# EAGLE schematic ODB21 (EAGLE 9.2.2)
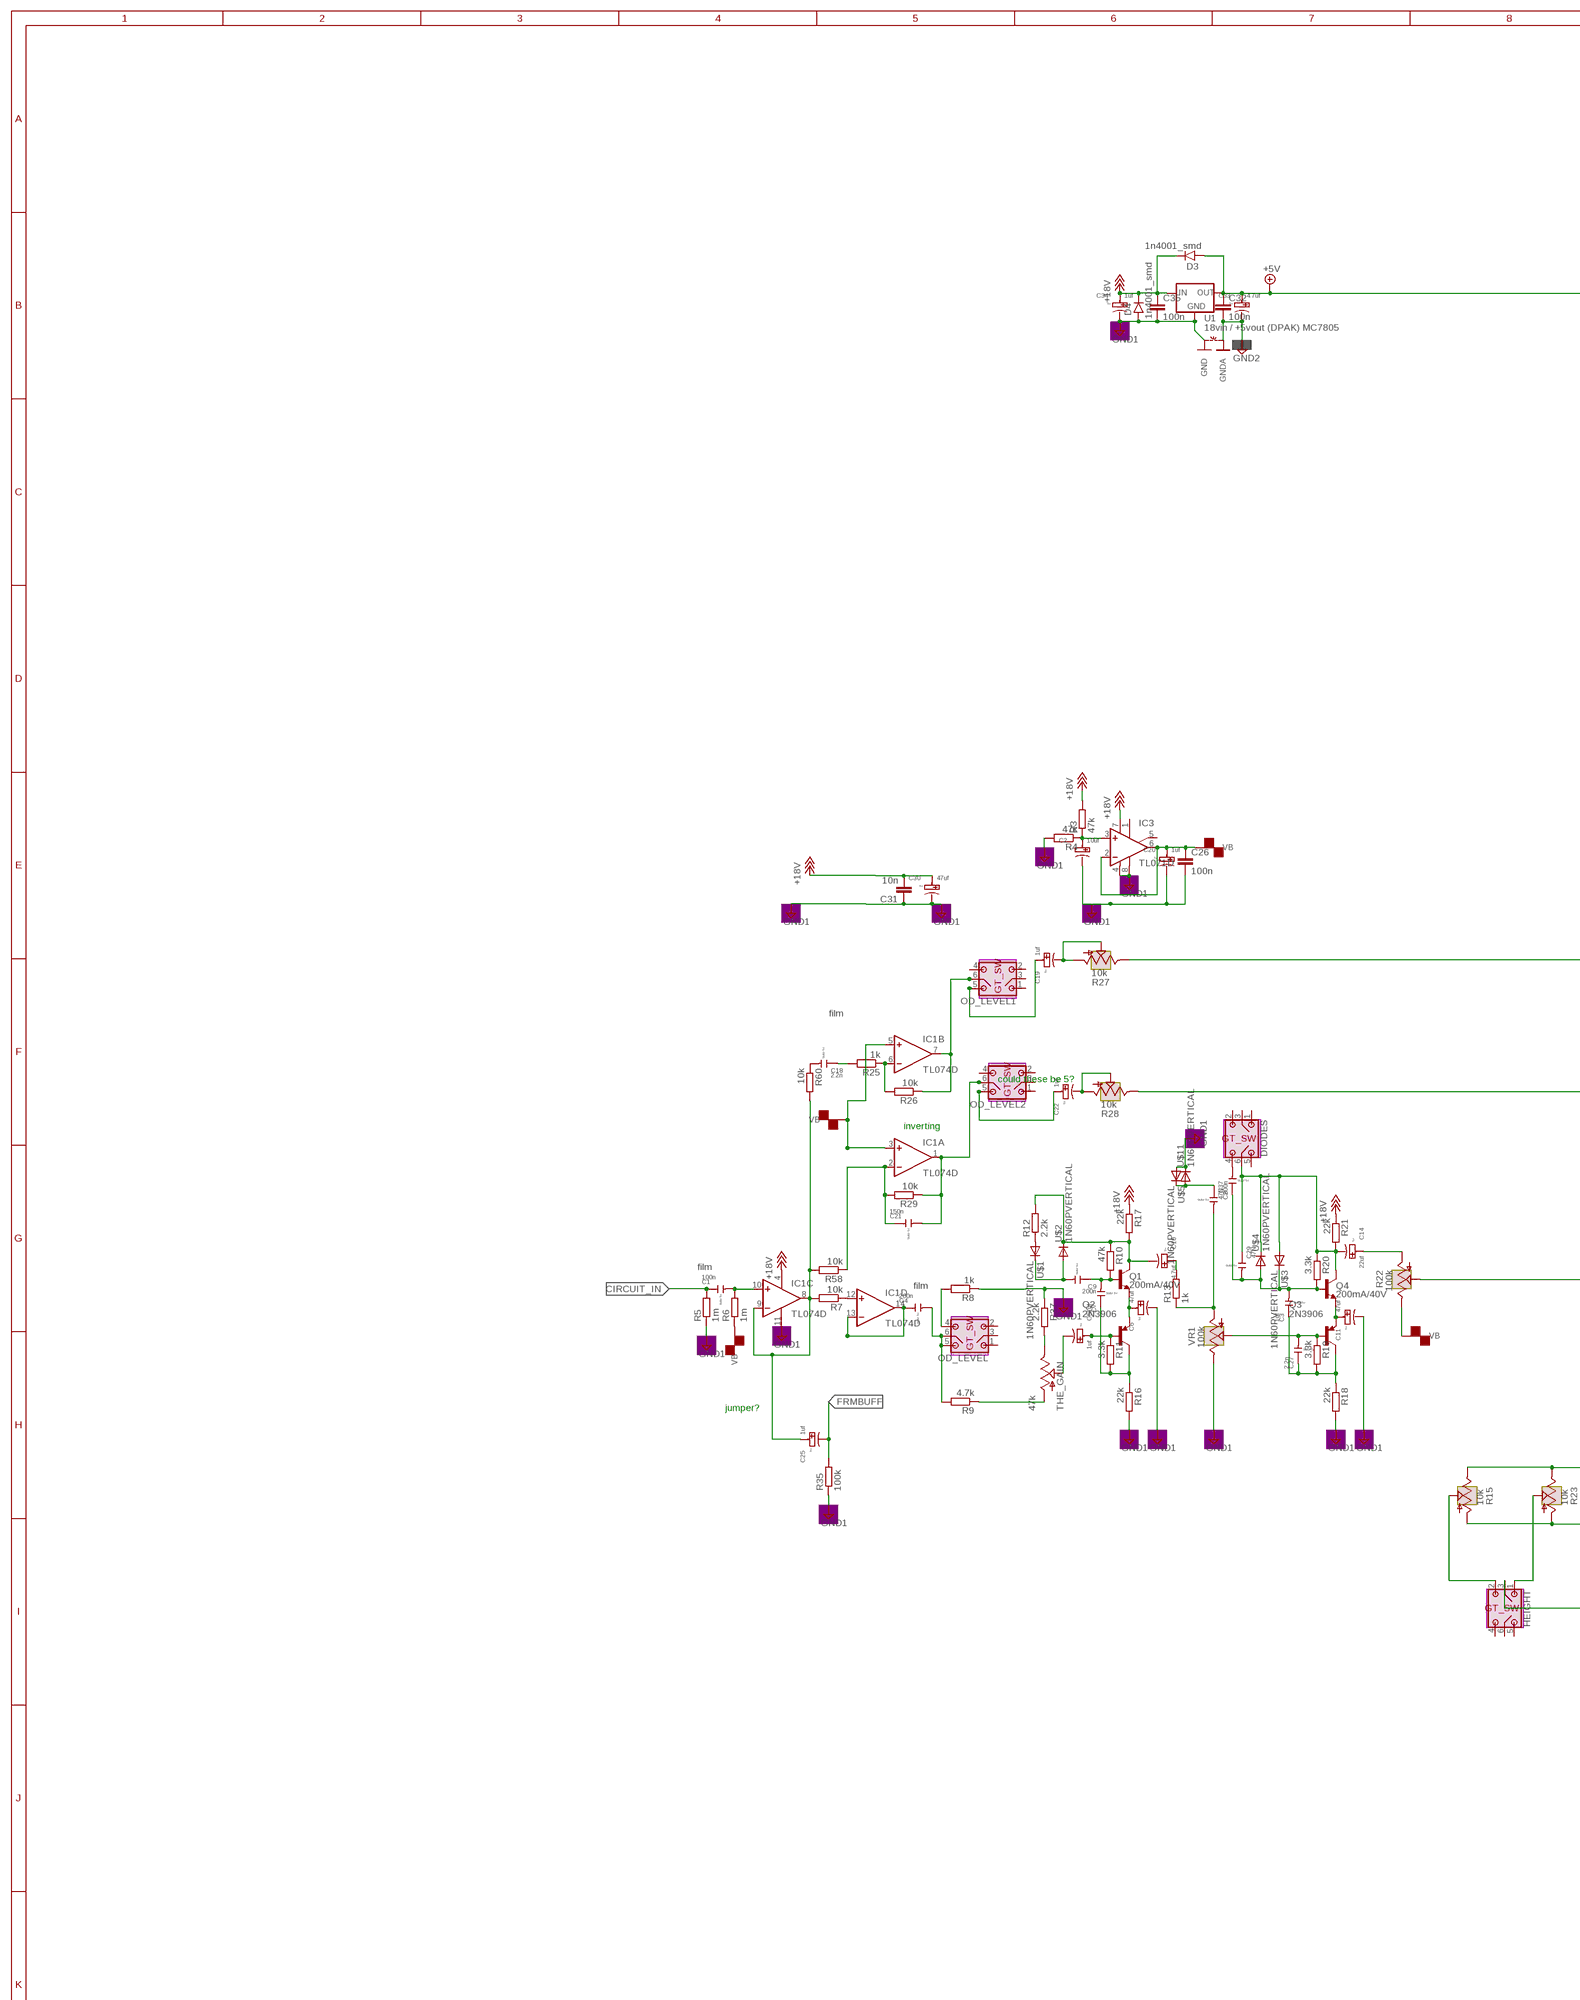
[diagram p0: schematic, sheet 1, part 1 of 3]
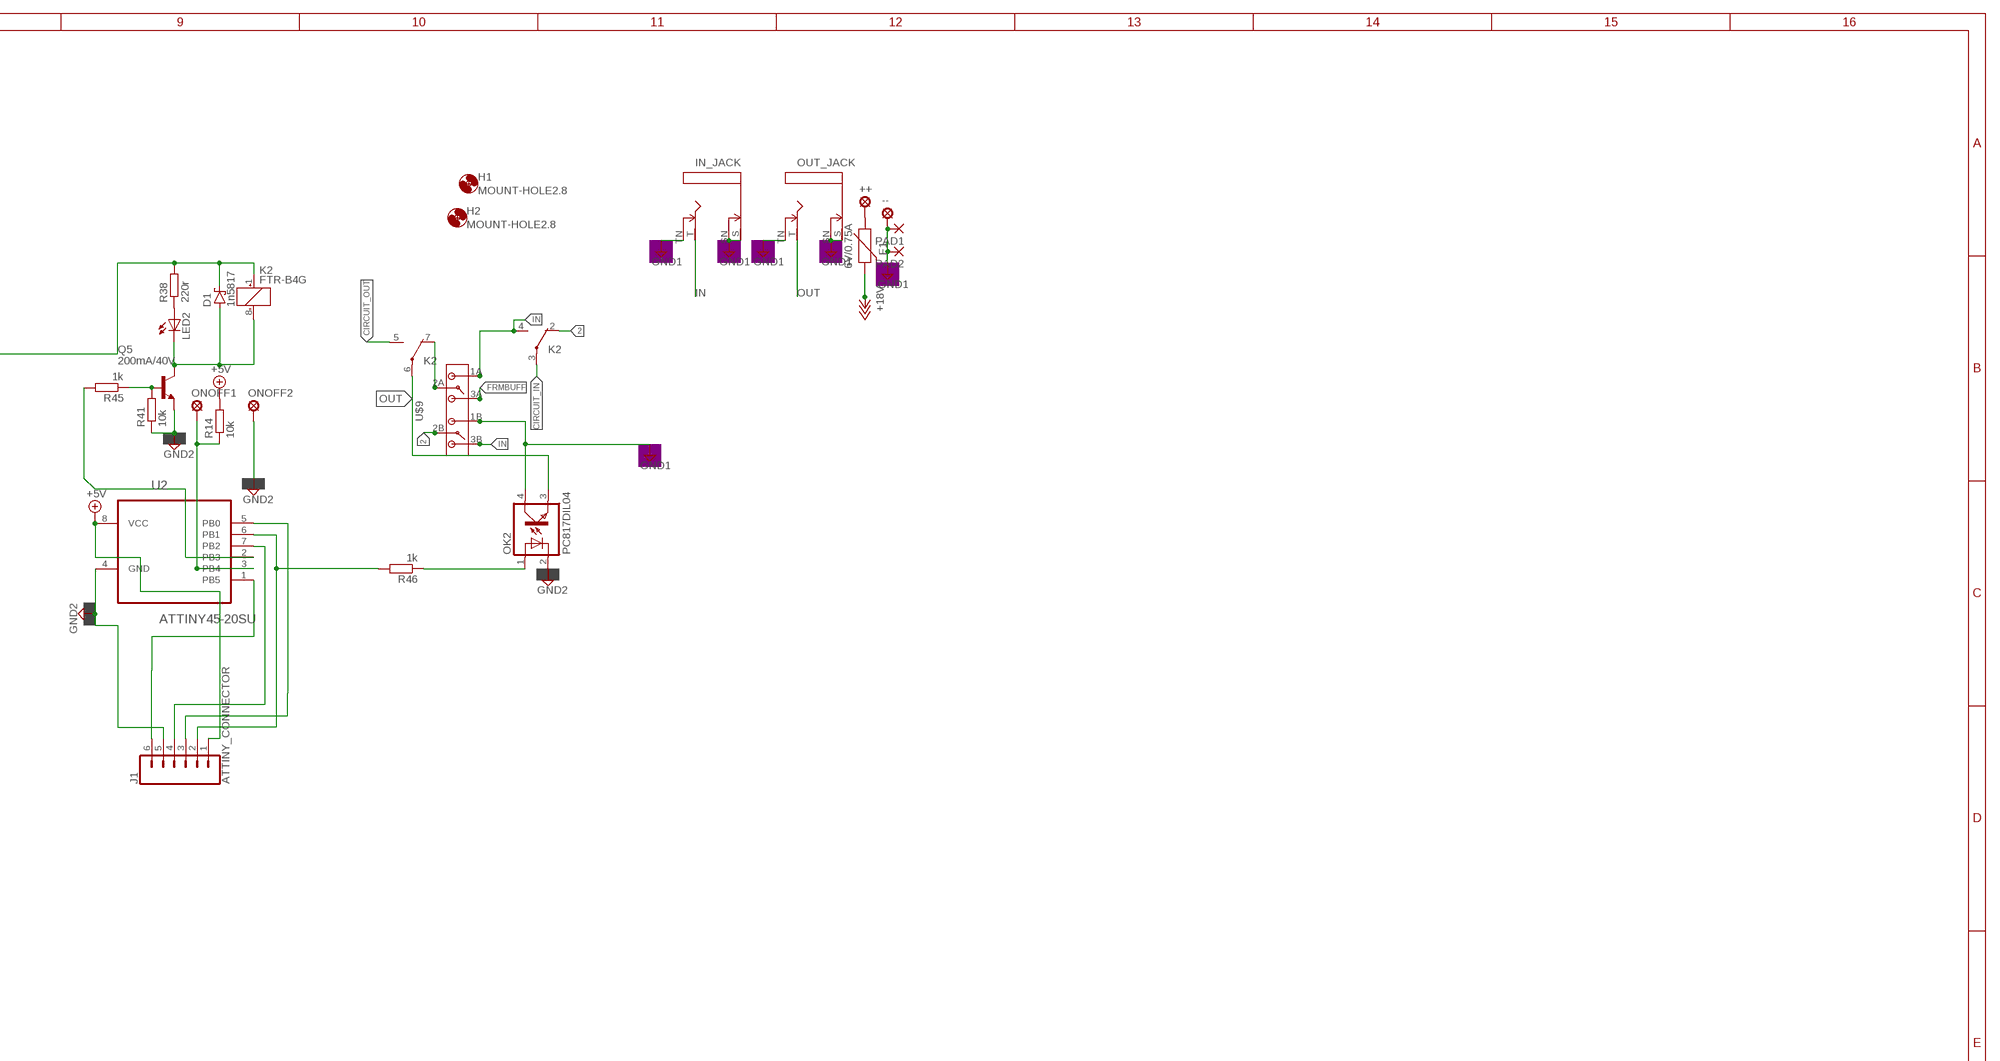
[diagram p1: schematic, sheet 1, part 2 of 3]
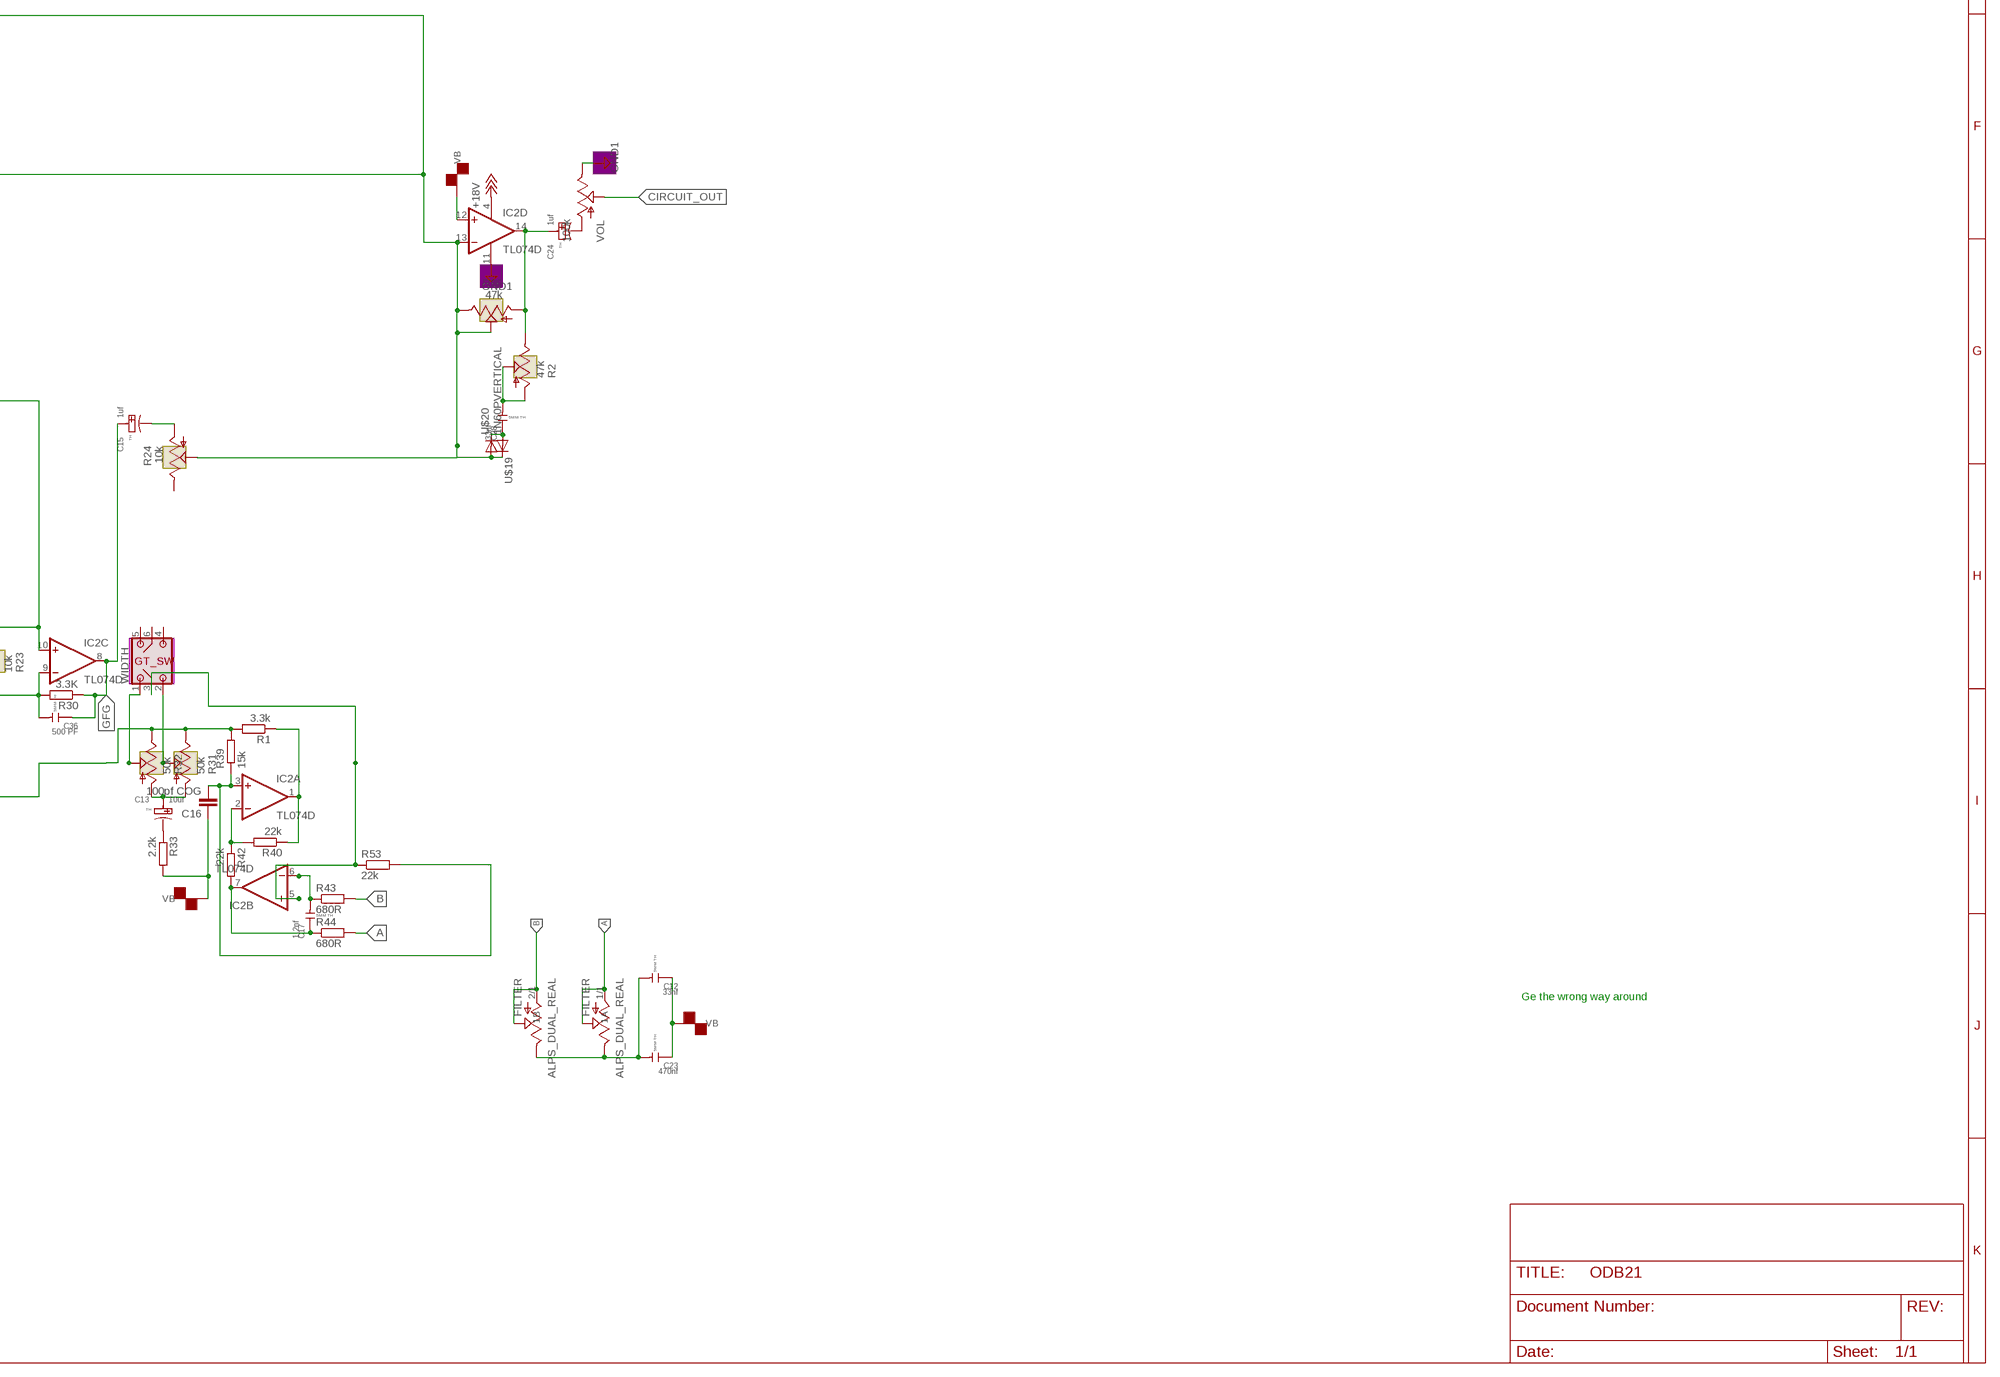
[diagram p2: schematic, sheet 1, part 3 of 3]

## Parts
++  LSP10  [LSP10]
--  LSP10  [LSP10]
C1  100n  THRU_HOLE_5MM_SPACING  [CERAMIC-5MM]
C2  10uf  THRU-HOLE-POLARIZED  [PC-D5.3MM]
C3  1uf  THRU_HOLE_5MM_SPACING  [CERAMIC-5MM]
C4  200n  THRU_HOLE_5MM_SPACING  [CERAMIC-5MM]
C5  1uf  THRU-HOLE-POLARIZED  [PC-D5.3MM]
C6  47uf  THRU-HOLE-POLARIZED  [PC-D5.3MM]
C7  1uf  THRU_HOLE_5MM_SPACING  [CERAMIC-5MM]
C8  47N  THRU_HOLE_5MM_SPACING  [CERAMIC-5MM]
C9  200n  THRU_HOLE_5MM_SPACING  [CERAMIC-5MM]
C10  4.7uf  THRU-HOLE-POLARIZED  [PC-D5.3MM]
C11  47uf  THRU-HOLE-POLARIZED  [PC-D5.3MM]
C12  33nf  THRU_HOLE_5MM_SPACING  [CERAMIC-5MM]
C13  10uf  THRU-HOLE-POLARIZED  [PC-D5.3MM]
C14  22uf  THRU-HOLE-POLARIZED  [PC-D5.3MM]
C15  1uf  THRU-HOLE-POLARIZED  [PC-D5.3MM]
C16  100pf COG  C-EUC1206  [C1206]
C17  1.2nf  THRU_HOLE_5MM_SPACING  [CERAMIC-5MM]
C18  2.2n  THRU_HOLE_5MM_SPACING  [CERAMIC-5MM]
C19  1uf  THRU-HOLE-POLARIZED  [PC-D5.3MM]
C20  1uf  THRU-HOLE-POLARIZED  [PC-D5.3MM]
C21  150n  THRU_HOLE_5MM_SPACING  [CERAMIC-5MM]
C22  1uf  THRU-HOLE-POLARIZED  [PC-D5.3MM]
C23  470nf  THRU_HOLE_5MM_SPACING  [CERAMIC-5MM]
C24  1uf  THRU-HOLE-POLARIZED  [PC-D5.3MM]
C25  1uf  THRU-HOLE-POLARIZED  [PC-D5.3MM]
C26  100n  C-EUC1206  [C1206]
C27  2.2n  THRU_HOLE_5MM_SPACING  [CERAMIC-5MM]
C28  33nf  THRU_HOLE_5MM_SPACING  [CERAMIC-5MM]
C29  47N  THRU_HOLE_5MM_SPACING  [CERAMIC-5MM]
C30  47uf  THRU-HOLE-POLARIZED  [PC-D5.3MM]
C31  10n  C-EUC1206  [C1206]
C32  100n  C-EUC1206  [C1206]
C33  4.7uf  THRU-HOLE-POLARIZED  [PC-D5.3MM]
C34  1uf  THRU-HOLE-POLARIZED  [PC-D5.3MM]
C35  100n  C-EUC1206  [C1206]
C36  500 PF  THRU_HOLE_5MM_SPACING  [CERAMIC-5MM]
C37  200n  THRU_HOLE_5MM_SPACING  [CERAMIC-5MM]
D1  1n5817  SCHOTTKY-DIODESMD  [SMB]
D3  1n4001_smd  1N400X.1  [DO41-1]
D4  1n4001_smd  1N400X.1  [DO41-1]
DIODES  DP03  [DP-03]
F1  6V/0.75A  PPTC_THREE-QUARTER-AMP  [1206]
FILTER  ALPS_DUAL_REAL  [ALPS_QUAD]
H1  MOUNT-HOLE2.8  [2,8]
H2  MOUNT-HOLE2.8  [2,8]
HEIGHT  DP03  [DP-03]
IC1  TL074D  [SO14]
IC2  TL074D  [SO14]
IC3  TL071D  [SO08]
IN_JACK  MMMONNN  [MONO]
J1  ATTINY_CONNECTOR  CONN_06LONGPADS  [1X06_LONGPADS]
K2  FTR-B4G  [FTR-B4G]
LED2  LED3MM  [LED3MM]
OD_LEVEL  DP03  [DP-03]
OD_LEVEL1  DP03  [DP-03]
OD_LEVEL2  DP03  [DP-03]
OK2  PC817DIL04  [SMD4]
ONOFF1  LSP10  [LSP10]
ONOFF2  LSP10  [LSP10]
OUT_JACK  MMMONNN  [MONO]
PAD1  SMD5  [SMD2,54-5,08]
PAD2  SMD5  [SMD2,54-5,08]
Q1  200mA/40V  TRANS_NPN-2N3904  [TO-92]
Q2  2N3906  [TO92]
Q3  2N3906  [TO92]
Q4  200mA/40V  TRANS_NPN-2N3904  [TO-92]
Q5  200mA/40V  BC547  [TO92]
R1  3.3k  R-EU_R1206  [R1206]
R2  47k  TRIM_US-B25P  [B25P]
R3  47k  R-EU_R1206  [R1206]
R4  47k  R-EU_R1206  [R1206]
R5  1m  R-EU_R1206  [R1206]
R6  1m  R-EU_R1206  [R1206]
R7  10k  R-EU_R1206  [R1206]
R8  1k  R-EU_R1206  [R1206]
R9  4.7k  R-EU_R1206  [R1206]
R10  47k  R-EU_R1206  [R1206]
R11  3.3k  R-EU_R1206  [R1206]
R12  2.2k  R-EU_R1206  [R1206]
R13  1k  R-EU_R1206  [R1206]
R14  10k  R-EU_M1206  [M1206]
R15  10k  TRIM_US-3223G  [3223G]
R16  22k  R-EU_R1206  [R1206]
R17  22k  R-EU_R1206  [R1206]
R18  22k  R-EU_R1206  [R1206]
R19  3.3k  R-EU_R1206  [R1206]
R20  3.3k  R-EU_R1206  [R1206]
R21  22k  R-EU_R1206  [R1206]
R22  100k  TRIM_US-3223G  [3223G]
R23  10k  TRIM_US-3223G  [3223G]
R24  10k  TRIM_US-3223G  [3223G]
R25  1k  R-EU_R1206  [R1206]
R26  10k  R-EU_R1206  [R1206]
R27  10k  TRIM_US-3223G  [3223G]
R28  10k  TRIM_US-3223G  [3223G]
R29  10k  R-EU_R1206  [R1206]
R30  3.3K  R-EU_R1206  [R1206]
R31  50k  TRIM_US-3223G  [3223G]
R32  50k  TRIM_US-3223G  [3223G]
R33  2.2k  R-EU_R1206  [R1206]
R35  100k  R-EU_R1206  [R1206]
R36  47k  TRIM_US-3223G  [3223G]
R37  2.2k  R-EU_R1206  [R1206]
R38  220r  R-EU_M1206  [M1206]
R39  15k  R-EU_R1206  [R1206]
R40  22k  R-EU_R1206  [R1206]
R41  10k  R-EU_M1206  [M1206]
R42  22k  R-EU_R1206  [R1206]
R43  680R  R-EU_R1206  [R1206]
R44  680R  R-EU_R1206  [R1206]
R45  1k  R-EU_M1206  [M1206]
R46  1k  R-EU_M1206  [M1206]
R53  22k  R-EU_R1206  [R1206]
R58  10k  R-EU_R1206  [R1206]
R60  10k  R-EU_R1206  [R1206]
THE_GAIN  47k  POT  [ALPS_POT]
U1  18vin / +5vout (DPAK) MC7805  V_REG_78XX7812  [TO-252]
U2  ATTINY45-20SU  [SOIC127P798X216-8N]
U$1  1N60PVERTICAL  [DO41-1]
U$2  1N60PVERTICAL  [DO41-1]
U$3  1N60PVERTICAL  [DO41-1]
U$4  1N60PVERTICAL  [DO41-1]
U$5  1N60PVERTICAL  [DO41-1]
U$9  BYSWITCH  [BUFF/TRBYPASS]
U$11  1N60PVERTICAL  [DO41-1]
U$19  1N60PVERTICAL  [DO41-1]
U$20  1N60PVERTICAL  [DO41-1]
VOL  100k  POT  [ALPS_POT]
VR1  100k  TRIM_US-3223G  [3223G]
WIDTH  DP03  [DP-03]
~NUDEV~1  GND-GNDA1,27MM  [GND-GNDA-1,27MM]

## Nets
2: K2.2(-1:O) U$9.2B
+5V: C32.1 C33.+ D1.C D3.A J1.1 K2.1(K:+) R14.2 R38.2 U1.2(OUT) U2.8(VCC)
+18V: C30.+ C31.2 C34.+ C35.1 D3.C D4.C F1.2 IC1.4(P:V+) IC2.4(P:V+) IC3.7(V+) R3.2 R17.1 R21.1 U1.1(IN)
A: FILTER.1/1(1A) FILTER.1/2(2A) R44.2
B: FILTER.2/1(1B) FILTER.2/2(2B) R43.2
CIRCUIT_IN: C1.1 K2.3(-1:P) R5.2
CIRCUIT_OUT: K2.5(-2:S) VOL.P$2(S)
FRMBUFF: C25.- R35.2 U$9.3A
GFG: C15.+ C36.1 IC2.8(C:OUT) R30.1
GND1: --.MP C2.- C6.- C11.- C20.- C26.2 C30.- C31.1 C34.- C35.2 D4.A IC1.11(P:V-) IC2.11(P:V-) IC3.4(V-) IC3.8(OPT) IN_JACK.S IN_JACK.SN IN_JACK.TN OK2.4(COL) OUT_JACK.S OUT_JACK.SN OUT_JACK.TN PAD1.1(P) PAD2.1(P) R4.2 R5.1 R8.1 R16.2 R18.2 R35.1 R37.1 U1.3(GND) U$5.A U$9.1B U$11.C VOL.P$1(E) VR1.3(E) ~NUDEV~1.GND
GND2: C32.2 C33.- J1.5 OK2.2(C) ONOFF2.MP Q5.1(E) R41.1 U2.4(GND) ~NUDEV~1.GNDA
IN: IN_JACK.T K2.4(-1:S) U$9.1A U$9.3B
N$1: R12.1 U$1.A
N$2: C14.+ R22.1(A)
N$3: C2.+ IC3.3(+IN) R3.1 R4.1
N$4: C9.2 U$1.C U$2.A
N$5: C1.2 IC1.10(C:+IN) R6.2
N$6: C4.2 OD_LEVEL.5 OD_LEVEL.6 R9.2
N$7: C15.- R24.1(A)
N$8: IC1.12(D:+IN) R7.1
N$9: ++.MP F1.1
N$10: C4.1 IC1.13(D:-IN) IC1.14(D:OUT)
N$11: OD_LEVEL.4 R8.2
N$12: R9.1 THE_GAIN.P$3(A)
N$13: C5.- THE_GAIN.P$2(S)
N$14: C5.+ Q2.2(B) R11.1
N$15: C6.+ Q1.1(E) Q2.3(E)
N$16: C7.2 C9.1 Q1.2(B) R10.2
N$17: R37.2 THE_GAIN.P$1(E)
N$18: C7.1 Q2.1(C) R11.2 R16.1
N$19: C37.2 R13.1 VR1.1(A)
N$20: C8.2 DIODES.4
N$21: C22.- R28.1(A) R28.2(S)
N$22: C25.+ IC1.8(C:OUT) IC1.9(C:-IN) R7.2 R58.2 R60.2
N$23: C10.- Q1.3(C) R10.1 R12.2 R17.2 U$2.C
N$24: C24.- VOL.P$3(A)
N$25: C11.+ Q3.3(E) Q4.1(E)
N$26: C10.+ R13.2
N$27: IC2.10(C:+IN) R15.3(E) R22.2(S) R23.3(E)
N$28: C3.1 C27.1 Q3.1(C) R18.1 R19.2
N$29: C27.2 Q3.2(B) R19.1 VR1.2(S)
N$30: C22.+ OD_LEVEL2.5
N$31: C28.2 R2.A R2.S
N$32: C36.2 IC2.9(C:-IN) R15.1(A) R23.1(A) R30.2
N$33: HEIGHT.2 R15.2(S)
N$34: HEIGHT.1 R23.2(S)
N$35: HEIGHT.3 R1.2 R31.3(E) R32.3(E) R39.2
N$36: C18.2 R60.1
N$37: C13.+ R31.1(A) R32.1(A)
N$38: C13.- R33.1
N$39: C16.2 IC2.3(A:+IN) R39.1 R53.2
N$40: R31.2(S) WIDTH.2
N$41: C18.1 R25.2
N$42: C12.2 C23.2 FILTER.1/3(3A) FILTER.2/3(3B)
N$43: IC1.6(B:-IN) R25.1 R26.2
N$44: R32.2(S) WIDTH.1
N$45: IC2.5(B:+IN) R53.1 WIDTH.3
N$46: C19.+ OD_LEVEL1.5
N$47: C19.- R27.1(A) R27.2(S)
N$48: IC2.1(A:OUT) R1.1 R40.1
N$49: C17.1 IC2.7(B:OUT) R42.2 R44.1
N$50: IC2.2(A:-IN) R40.2 R42.1
N$51: C3.2 C8.1 C29.2 Q4.2(B) R20.2 U$3.C U$4.A
N$52: IC1.7(B:OUT) OD_LEVEL1.6 R26.1
N$53: C17.2 IC2.6(B:-IN) R43.1
N$54: C21.2 IC1.1(A:OUT) OD_LEVEL2.6 R29.1
N$55: C37.1 U$5.C U$11.A
N$56: C21.1 IC1.2(A:-IN) R29.2 R58.1
N$57: C28.1 U$19.A U$20.C
N$59: K2.7(-2:O) U$9.2A
N$60: IC2.13(D:-IN) R24.2(S) R27.3(E) R28.3(E) R36.2(S) R36.3(E) U$19.C U$20.A
N$62: C24.+ IC2.14(D:OUT) R2.E R36.1(A)
N$63: C14.- C29.1 DIODES.6 Q4.3(C) R20.1 R21.2 U$3.A U$4.C
N$74: J1.3 U2.5(PB0)
N$75: J1.2 R46.2 U2.6(PB1)
N$76: J1.4 U2.7(PB2)
N$77: J1.6 U2.1(PB5)
N$78: LED2.A R38.1
N$79: D1.A K2.8(K:-) LED2.K(C) Q5.3(C)
N$84: Q5.2(B) R41.2 R45.1
N$85: R45.2 U2.2(PB3)
N$87: ONOFF1.MP R14.1 U2.3(PB4)
N$88: OK2.1(A) R46.1
OUT: K2.6(-2:P) OK2.3(EMIT) OUT_JACK.T
VB: C12.1 C16.1 C20.+ C23.1 C26.1 IC1.3(A:+IN) IC1.5(B:+IN) IC2.12(D:+IN) IC3.2(-IN) IC3.6(OUT) R6.1 R22.3(E) R33.2
Unconnected: DIODES.1 DIODES.2 DIODES.3 DIODES.5 HEIGHT.4 HEIGHT.5 HEIGHT.6 IC3.1(ON1) IC3.5(ON2) OD_LEVEL1.1 OD_LEVEL1.2 OD_LEVEL1.3 OD_LEVEL1.4 OD_LEVEL2.1 OD_LEVEL2.2 OD_LEVEL2.3 OD_LEVEL2.4 OD_LEVEL.1 OD_LEVEL.2 OD_LEVEL.3 R24.3(E) WIDTH.4 WIDTH.5 WIDTH.6

## Notes on the sheet
- film
- could these be 5?
- inverting
- film
- film
- jumper?
- Ge the wrong way around

## Library data of the parts
++ -- ONOFF1 ONOFF2 = solpad:LSP10: SOLDER PAD drill 1.0 mm, distributor Buerklin, 12H555
C1 C3 C4 C7-C9 C12 C17 C18 C21 C23 C27-C29 C36 C37 = GT_Capacitor:THRU_HOLE_5MM_SPACING: 302010202; PACKAGE: 5MM TH
C2 C5 C6 C10 C11 C13-C15 C19 C20 C22 C24 C25 C30 C33 C34 = GT_Capacitor:THRU-HOLE-POLARIZED: 302030033; PACKAGE: TH
C16 C26 C31 C32 C35 = resistor:C-EU: CAPACITOR, European symbol
D1 = diode:SCHOTTKY-DIODE: Schottky Diode
D3 D4 = gm-diodes:1N400X: Rectifier Diodes often used in power supply to prevent damage from reverse polarization
DIODES HEIGHT OD_LEVEL OD_LEVEL1 OD_LEVEL2 WIDTH = switch-dil:DP03: DIL/CODE SWITCH; MPN: MCDP03; OC_FARNELL: 1522004; OC_NEWARK: 74M2976
F1 = GOLDTOOTH-Fuses:PPTC: Resettable Fuse PPTC Resettable Fuse. Really a sort of resistor with a polymeric positive temperature coefficient whose resistance increases dramatically with an increase in temperature. When heated by the power passing through the resistance rises causing the current to be limited, protecting the circuit. This is achieved by the transition of the polymer from a crystalline to an amorphous state where the conductive carbon separates breaking the conductive pathways found in the cool crystalline structure. When a PPTC cools back down it resumes conducting letting the circuit turn back on. SparkFun Products: SparkFun RedBoard - Programmed with Arduino <https://www.sparkfun.com/products/12757> Pro Micro - 5V/16MHz <https://www.sparkfun.com/products/12640> Arduino Pro 328 - 5V/16MHz <https://www.sparkfun.com/products/10915> MP3 Trigger <https://www.sparkfun.com/products/13720>; PROD_ID: RES-11150
FILTER = GOLD_QUAD:ALPS_DUAL_REAL
H1 H2 = holes:MOUNT-HOLE: MOUNTING HOLE with drill center marker
IC1 IC2 = linear:TL074: OP AMP
IC3 = linear:TL071: OP AMP
IN_JACK OUT_JACK = gm-jacks2:MMMONNN
J1 = GT_Connectors:CONN_06: Multi connection point. Often used as Generic Header-pin footprint for 0.1 inch spaced/style header connections On any of the 0.1 inch spaced packages, you can populate with these: Break Away Headers - Straight <https://www.sparkfun.com/products/116> (PRT-00116) Break Away Male Headers - Right Angle <https://www.sparkfun.com/products/553> (PRT-00553) Female Headers <https://www.sparkfun.com/products/115> (PRT-00115) Break Away Headers - Machine Pin <https://www.sparkfun.com/products/117> (PRT-00117) Break Away Female Headers - Swiss Machine Pin <https://www.sparkfun.com/products/743> (PRT-00743) Arduino Stackable Header - 6 Pin <https://www.sparkfun.com/products/9280> (PRT-09280) For SCREWTERMINALS and SPRING TERMINALS visit here: Screw Terimnals on SparkFun.com <https://www.sparkfun.com/search/results?term=Screw+Terminals> (5mm/3.5mm/2.54mm spacing) This device is also useful as a general connection point to wire up your design to another part of your project. Our various solder wires solder well into these plated through hole pads. Hook-Up Wire - Assortment (Stranded, 22 AWG) <https://www.sparkfun.com/products/11375> (PRT-11375) Hook-Up Wire - Assortment (Solid Core, 22 AWG) <https://www.sparkfun.com/products/11367> (PRT-11367) View the entire wire category on our website here <https://www.sparkfun.com/categories/141>
K2 = relay:FTR-B4: ULTRA MINIATURE RELAY 2 POLES - 2 A (Slim Profile Signal Relay) FUJITSU FTR-B4 SERIES Source: FTR-B4.pdf
LED2 = GOLDTOOTH_LED:LED: LED OSRAM: - CHIPLED LG R971, LG N971, LY N971, LG Q971, LY Q971, LO R971, LY R971 LH N974, LH R974 LS Q976, LO Q976, LY Q976 LO Q996 - Hyper CHIPLED LW Q18S LB Q993, LB Q99A, LB R99A - SideLED LS A670, LO A670, LY A670, LG A670, LP A670 LB A673, LV A673, LT A673, LW A673 LH A674 LY A675 LS A676, LA A676, LO A676, LY A676, LW A676 LS A679, LY A679, LG A679 - Hyper Micro SIDELED® LS Y876, LA Y876, LO Y876, LY Y876 LT Y87S - SmartLED LW L88C, LW L88S LB L89C, LB L89S, LG L890 LS L89K, LO L89K, LY L89K LS L896, LA L896, LO L896, LY L896 - TOPLED LS T670, LO T670, LY T670, LG T670, LP T670 LSG T670, LSP T670, LSY T670, LOP T670, LYG T670 LG T671, LOG T671, LSG T671 LB T673, LV T673, LT T673, LW T673 LH T674 LS T676, LA T676, LO T676, LY T676, LB T676, LH T676, LSB T676, LW T676 LB T67C, LV T67C, LT T67C, LS T67K, LO T67K, LY T67K, LW E67C LS E67B, LA E67B, LO E67B, LY E67B, LB E67C, LV E67C, LT E67C LW T67C LS T679, LY T679, LG T679 LS T770, LO T770, LY T770, LG T770, LP T770 LB T773, LV T773, LT T773, LW T773 LH T774 LS E675, LA E675, LY E675, LS T675 LS T776, LA T776, LO T776, LY T776, LB T776 LHGB T686 LT T68C, LB T68C - Hyper Mini TOPLED® LB M676 - Mini TOPLED Santana® LG M470 LS M47K, LO M47K, LY M47K Source: http://www.osram.convergy.de LUXEON: - LUMILED® LXK2-PW12-R00, LXK2-PW12-S00, LXK2-PW14-U00, LXK2-PW14-V00 LXK2-PM12-R00, LXK2-PM12-S00, LXK2-PM14-U00 LXK2-PE12-Q00, LXK2-PE12-R00, LXK2-PE12-S00, LXK2-PE14-T00, LXK2-PE14-U00 LXK2-PB12-K00, LXK2-PB12-L00, LXK2-PB12-M00, LXK2-PB14-N00, LXK2-PB14-P00, LXK2-PB14-Q00 LXK2-PR12-L00, LXK2-PR12-M00, LXK2-PR14-Q00, LXK2-PR14-R00 LXK2-PD12-Q00, LXK2-PD12-R00, LXK2-PD12-S00 LXK2-PH12-R00, LXK2-PH12-S00 LXK2-PL12-P00, LXK2-PL12-Q00, LXK2-PL12-R00 Source: www.luxeon.com KINGBRIGHT: KA-3528ASYC Source: www.kingbright.com
OK2 = GT_optocoupler:PC817: SHARP OPTO COUPLER
PAD1 PAD2 = wirepad:SMD5: SMD PAD
Q1 Q4 = SparkFun-DiscreteSemi:TRANS_NPN: NPN transistor Current controlled devices typically used to amplify current or used as a switch. BC547 - COM-08928 <http://www.sparkfun.com/products/8928> (TO-92 45V 100mA) (1.Collector 2.Base 3.Emitter) 2N3904 - COM-00521 <http://www.sparkfun.com/products/521> (TO-92 40V 200mA) (1.Emitter 2.Base 3.Collector) P2N2222A - COM-12852 <http://www.sparkfun.com/products/12852> (TO-92 40V 600mA) (1.Collector 2.Base 3.Emitter); PROD_ID: TRANS-08447
Q2 Q3 = transistor-pnp:2N3906: PNP Transistor
Q5 = transistor-npn:BC547*: NPN Transistor
R1 R3-R14 R16-R21 R25 R26 R29 R30 R33 R35 R37-R46 R53 R58 R60 = resistor:R-EU_: RESISTOR, European symbol
R2 R15 R22-R24 R27 R28 R31 R32 R36 VR1 = pot:TRIM_US-: POTENTIOMETER
THE_GAIN VOL = SparkFun-Electromechanical:POT
U1 = SparkFun-IC-Power:V_REG_78XX: Voltage Regulator Standard 78xx regulator. IGO (Input Ground Output). Spark Fun Electronics SKU : COM-00107; PROD_ID: VREG-12370; VALUE: +12v
U2 = Atmel_By_element14_Batch_1-00:ATTINY45-20SU: 8-bit Microcontroller with 4 Bytes In-System Programmable Flash; MPN: ATTINY45-20SU; OC_FARNELL: 1288353; OC_NEWARK: 23M5073; PACKAGE: SOIC-8; SUPPLIER: Atmel
U$1-U$5 U$11 U$19 U$20 = diode:1N60P
U$9 = switch-dil:BYSWITCH
~NUDEV~1 = ground-junctions:GND-GNDA: Connect GND - GNDA without DRC-Error, display layer 53 (54) to make copper (ROUTE) from GND to GNDA Select also layer 53 (54) in CAM-Job!